# Altium schematic sheet FPGA.SchDoc
size B; SheetNumber: 2; SheetTotal: 5
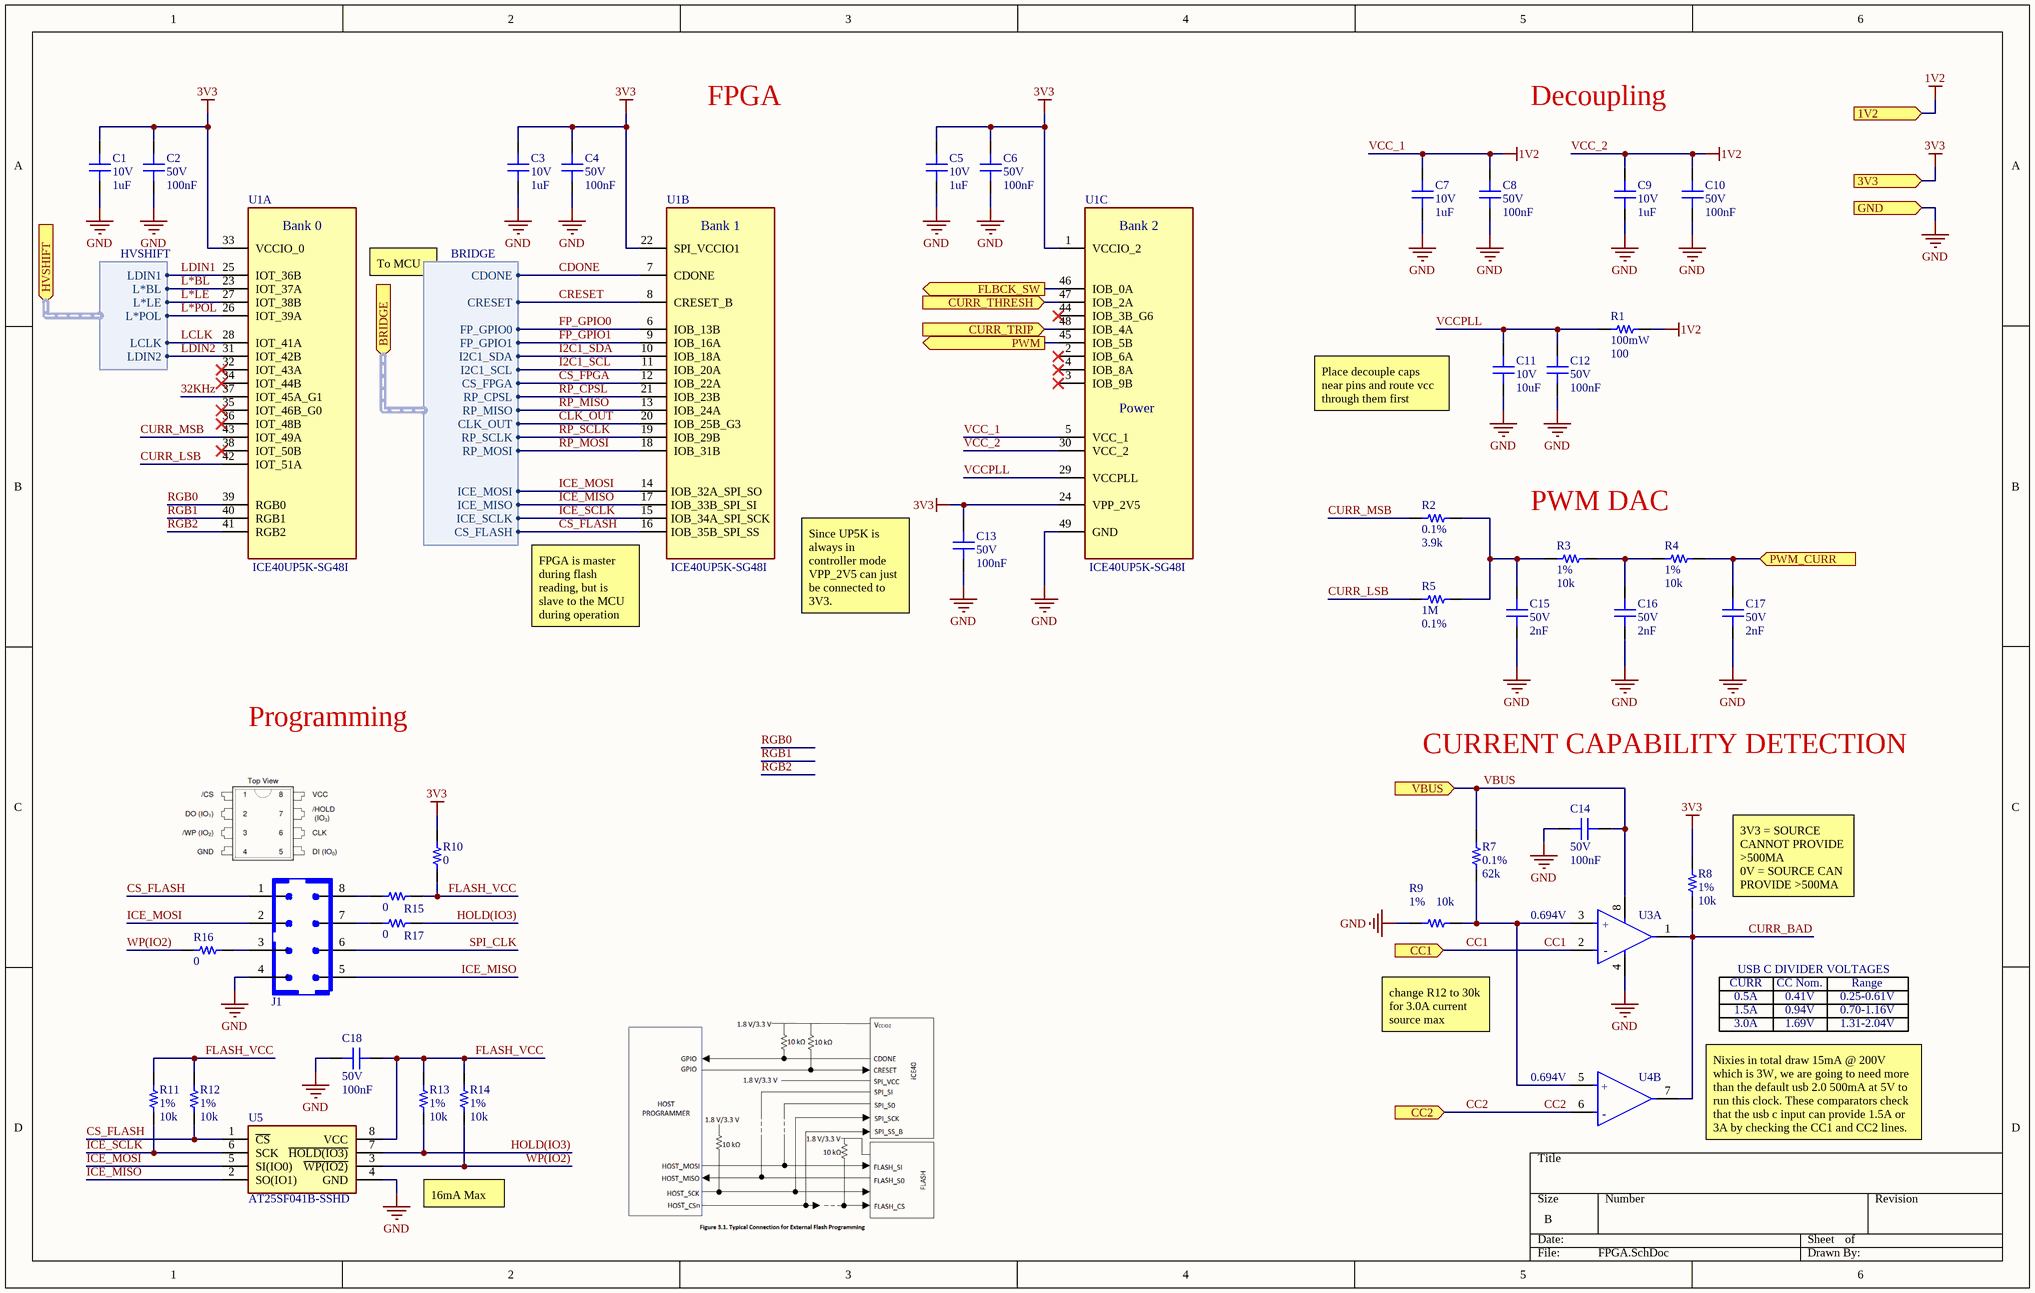
[diagram p0: FPGA.SchDoc]

## Parts
C1  Voltage Rating: 10V  Capacitance: 1uF  [0603]  (hidden comment: CL10B105KP8NFNC)
C2  Voltage Rating: 50V  Capacitance: 100nF  [0603]  (hidden comment: MT18B104K500CT)
C3  Voltage Rating: 10V  Capacitance: 1uF  [0603]  (hidden comment: CL10B105KP8NFNC)
C4  Voltage Rating: 50V  Capacitance: 100nF  [0603]  (hidden comment: MT18B104K500CT)
C5  Voltage Rating: 10V  Capacitance: 1uF  [0603]  (hidden comment: CL10B105KP8NFNC)
C6  Voltage Rating: 50V  Capacitance: 100nF  [0603]  (hidden comment: MT18B104K500CT)
C7  Voltage Rating: 10V  Capacitance: 1uF  [0603]  (hidden comment: CL10B105KP8NFNC)
C8  Voltage Rating: 50V  Capacitance: 100nF  [0603]  (hidden comment: MT18B104K500CT)
C9  Voltage Rating: 10V  Capacitance: 1uF  [0603]  (hidden comment: CL10B105KP8NFNC)
C10  Voltage Rating: 50V  Capacitance: 100nF  [0603]  (hidden comment: MT18B104K500CT)
C11  Voltage Rating: 10V  Capacitance: 10uF  [0603]  (hidden comment: 0603X106M100CT)
C12  Voltage Rating: 50V  Capacitance: 100nF  [0603]  (hidden comment: MT18B104K500CT)
C13  Voltage Rating: 50V  Capacitance: 100nF  [0603]  (hidden comment: MT18B104K500CT)
C14  Voltage Rating: 50V  Capacitance: 100nF  [0603]  (hidden comment: MT18B104K500CT)
C15  Voltage Rating: 50V  Capacitance: 2nF  [0603]  (hidden comment: GRM1885C1H202JA01D)
C16  Voltage Rating: 50V  Capacitance: 2nF  [0603]  (hidden comment: GRM1885C1H202JA01D)
C17  Voltage Rating: 50V  Capacitance: 2nF  [0603]  (hidden comment: GRM1885C1H202JA01D)
C18  Voltage Rating: 50V  Capacitance: 100nF  [0603]  (hidden comment: MT18B104K500CT)
J1  IDC 2x4 2.54mm DC3-8P  [2.54mm Pitch 1.1mm Drill 2x4P]  (value not drawn)
R1  Power Rating: 100mW  Resistance: 100  [0603]  (hidden comment: CRG0603F100R)
R2  Tolerance: 0.1%  Resistance: 3.9k  [0603]  (hidden comment: CPF0603B3K9E1)
R3  Tolerance: 1%  Resistance: 10k  [0603]  (hidden comment: CRG0603F10K)
R4  Tolerance: 1%  Resistance: 10k  [0603]  (hidden comment: CRG0603F10K)
R5  Resistance: 1M  Tolerance: 0.1%  [0603]  (hidden comment: CPF0603B1M0E)
R7  Tolerance: 0.1%  Resistance: 62k  [0603]  (hidden comment: CPF0603B62KE1)
R8  Tolerance: 1%  Resistance: 10k  [0603]  (hidden comment: CRG0603F10K)
R9  Tolerance: 1%  Resistance: 10k  [0603]  (hidden comment: CRG0603F10K)
R10  Resistance: 0  [0603]  (hidden comment: RC0603JR-070RL)
R11  Tolerance: 1%  Resistance: 10k  [0603]  (hidden comment: CRG0603F10K)
R12  Tolerance: 1%  Resistance: 10k  [0603]  (hidden comment: CRG0603F10K)
R13  Tolerance: 1%  Resistance: 10k  [0603]  (hidden comment: CRG0603F10K)
R14  Tolerance: 1%  Resistance: 10k  [0603]  (hidden comment: CRG0603F10K)
R15  Resistance: 0  [0603]  (hidden comment: RC0603JR-070RL)
R16  Resistance: 0  [0603]  (hidden comment: RC0603JR-070RL)
R17  Resistance: 0  [0603]  (hidden comment: RC0603JR-070RL)
U1  ICE40UP5K-SG48I  [QFN-48]  (parts A,B,C of 3)
U3  LM393DR2G  [SOIC-8]  (value not drawn)  (part A of 2)
U4  LM393DR2G  [SOIC-8]  (value not drawn)  (part B of 2)
U5  AT25SF041B-SSHD  [SOIC-8]

## Ports
1V2 (in, see Top Sheet[1C], Power[6B]), 3V3 (in, see Top Sheet[1C], Nixie[1A], Power[6A]), BRIDGE (in, harness BRIDGE, see Top Sheet[1C], MCU[3B]), CC1 (in, see Top Sheet[2A], Power[2A]), CC2 (in, see Top Sheet[2B], Power[2B]), CURR_THRESH (in, see Top Sheet[2B], Power[4D]), CURR_TRIP (in, see Top Sheet[2B], Power[5D]), FLBCK_SW (out, see Top Sheet[2B], Power[1C]), GND (in, see Top Sheet[1C], Nixie[1A], Power[1D]), HVSHIFT (in, harness HVSHIFT, see Top Sheet[2A], Nixie[1C]), PWM (out, see Top Sheet[2B], Power[2D]), PWM_CURR (in), VBUS (in, see Top Sheet[2B], Power[4A])

## Harnesses
BRIDGE: CS_FLASH, ICE_SCLK, ICE_MOSI, ICE_MISO, CDONE, CRESET, CS_FPGA, RP_SCLK, RP_MOSI, RP_MISO, RP_CPSL, CLK_OUT, FP_GPIO1, FP_GPIO0, I2C1_SCL, I2C1_SDA
HVSHIFT: LDIN1, L*BL, L*LE, L*POL, LCLK, LDIN2

## Nets
3V3: C1.2 C2.2 C3.2 C4.2 C5.2 C6.2 C13.2 R8.2 R10.2 U1.1(VCCIO_2) U1.22(SPI_VCCIO1) U1.24(VPP_2V5) U1.33(VCCIO_0) ; port 3V3
GND: C1.1 C2.1 C3.1 C4.1 C5.1 C6.1 C7.1 C8.1 C9.1 C10.1 C11.1 C12.1 C13.1 C14.2 C15.1 C16.1 C17.1 C18.2 J1.4 R9.1 U1.49(GND) U3.4(GND) U5.4(GND) ; port GND
VCC_1: C7.2 C8.2 C9.2 C10.2 R1.2 U1.5(VCC_1) U1.30(VCC_2) ; port 1V2  [also labelled 1V2, VCC_2]
32KHz: U1.37(IOT_45A_G1)
CC1: U3.2(IN1-) ; port CC1
CC2: U4.6(IN2-) ; port CC2
CDONE: U1.7(CDONE) ; port BRIDGE.CDONE
CLK_OUT: U1.20(IOB_25B_G3) ; port BRIDGE.CLK_OUT
CRESET: U1.8(CRESET_B) ; port BRIDGE.CRESET
CS_FLASH: J1.1 R12.1 U1.16(IOB_35B_SPI_SS) U5.1(~{CS}) ; port BRIDGE.CS_FLASH
CS_FPGA: U1.12(IOB_22A) ; port BRIDGE.CS_FPGA
CURR_BAD: R8.1 U3.1(OUT1) U4.7(OUT2)
CURR_LSB: R5.1 U1.42(IOT_51A)
CURR_MSB: R2.1 U1.43(IOT_49A)
CURR_THRESH: U1.47(IOB_2A) ; port CURR_THRESH
CURR_TRIP: U1.48(IOB_4A) ; port CURR_TRIP
FLASH_VCC: C18.1 R10.1 R11.2 R12.2 R13.2 R14.2 R15.2 U5.8(VCC)
FLBCK_SW: U1.46(IOB_0A) ; port FLBCK_SW
FP_GPIO0: U1.6(IOB_13B) ; port BRIDGE.FP_GPIO0
FP_GPIO1: U1.9(IOB_16A) ; port BRIDGE.FP_GPIO1
HOLD(IO3): R13.1 R17.2 U5.7(~{HOLD(IO3)})
I2C1_SCL: U1.11(IOB_20A) ; port BRIDGE.I2C1_SCL
I2C1_SDA: U1.10(IOB_18A) ; port BRIDGE.I2C1_SDA
ICE_MISO: J1.5 U1.17(IOB_33B_SPI_SI) U5.2(SO(IO1)) ; port BRIDGE.ICE_MISO
ICE_MOSI: J1.2 U1.14(IOB_32A_SPI_SO) U5.5(SI(IO0)) ; port BRIDGE.ICE_MOSI
ICE_SCLK: R11.1 U1.15(IOB_34A_SPI_SCK) U5.6(SCK) ; port BRIDGE.ICE_SCLK
L*BL: U1.23(IOT_37A) ; port HVSHIFT.L*BL
L*LE: U1.27(IOT_38B) ; port HVSHIFT.L*LE
L*POL: U1.26(IOT_39A) ; port HVSHIFT.L*POL
LCLK: U1.28(IOT_41A) ; port HVSHIFT.LCLK
LDIN1: U1.25(IOT_36B) ; port HVSHIFT.LDIN1
LDIN2: U1.31(IOT_42B) ; port HVSHIFT.LDIN2
PWM: U1.45(IOB_5B) ; port PWM
PWM_CURR: C17.2 R4.1 ; port PWM_CURR
RGB0: U1.39(RGB0)
RGB1: U1.40(RGB1)
RGB2: U1.41(RGB2)
RP_CPSL: U1.21(IOB_23B) ; port BRIDGE.RP_CPSL
RP_MISO: U1.13(IOB_24A) ; port BRIDGE.RP_MISO
RP_MOSI: U1.18(IOB_31B) ; port BRIDGE.RP_MOSI
RP_SCLK: U1.19(IOB_29B) ; port BRIDGE.RP_SCLK
SPI_CLK: J1.6
VBUS: C14.1 R7.2 U3.8(V+) ; port VBUS
VCCPLL: C11.2 C12.2 R1.1 U1.29(VCCPLL)
WP(IO2): R14.1 R16.1 U5.3(~{WP(IO2)})
NetC15_2: C15.2 R2.2 R3.2 R5.2
NetC16_2: C16.2 R3.1 R4.2
NetJ1_3: J1.3 R16.2
NetJ1_7: J1.7 R17.1
NetJ1_8: J1.8 R15.1
NetR7_1: R7.1 R9.2 U3.3(IN1+) U4.5(IN2+)

Not connected (* = marked no-connect by the designer): U1 2(IOB_6A)* 3(IOB_9B)* 4(IOB_8A)* 32(IOT_43A)* 34(IOT_44B)* 35(IOT_46B_G0)* 36(IOT_48B)* 38(IOT_50B)* 44(IOB_3B_G6)*

## Notes on the sheet
- FPGA
- Decoupling
- To MCU
- Place decouple caps near pins and route vcc through them first
- PWM DAC
- (near U1) FPGA is master during flash reading, but is slave to the MCU during operation
- Since UP5K is always in controller mode VPP_2V5 can just be connected to 3V3.
- Programming
- CURRENT CAPABILITY DETECTION
- (near R8) 3V3 = SOURCE CANNOT PROVIDE >500MA
  0V = SOURCE CAN PROVIDE >500MA
- (near U3) 0.694V
- USB C DIVIDER VOLTAGES
- change R12 to 30k for 3.0A current source max
- CURR
- 0.5A
- 1.5A
- 3.0A
- CC Nom.
- 0.41V
- 0.94V
- 1.69V
- Range
- 0.25-0.61V
- 0.70-1.16V
- 1.31-2.04V
- (near U4) 0.694V
- Nixies in total draw 15mA @ 200V which is 3W, we are going to need more than the default usb 2.0 500mA at 5V to run this clock. These comparators check that the usb c input can provide 1.5A or 3A by checking the CC1 and CC2 lines.
- 16mA Max
- (in symbol ICE40UP5K-SG48I, part A) Bank 0
- (in symbol ICE40UP5K-SG48I, part B) Bank 1
- (in symbol ICE40UP5K-SG48I, part C) Bank 2; Power
- (in symbol LM393DR2G, part A) +; -
- (in symbol LM393DR2G, part B) +; -

## Library data of the parts
C1 C3 C5 C7 C9 = CL10B105KP8NFNC: 1 µF ±10% 10V Ceramic Capacitor X7R 0603 (1608 Metric); Dielectric: X7R; Tolerance: 10%
C2 C4 C6 C8 C10 C12-C14 C18 = MT18B104K500CT: 0.1 µF ±10% 50V Ceramic Capacitor X7R 0603 (1608 Metric); Dielectric: X7R; Tolerance: 10%
C11 = 0603X106M100CT: 10 µF ±20% 10V Ceramic Capacitor X5R 0603 (1608 Metric); Dielectric: X5R; Tolerance: 20%
C15-C17 = GRM1885C1H202JA01D: 2000 pF ±5% 50V Ceramic Capacitor C0G, NP0 0603 (1608 Metric); Dielectric: C0G (NP0); Tolerance: 5%
J1 = IDC 2x4 2.54mm DC3-8P: Straight idc box headers PCB CONNECTOR DOUBLE ROW DC3 HEADER; M/F: Male; Rows: 2; Pins: 8; Pitch: 2.54mm
R1 = CRG0603F100R: 100 Ohms ±1% 0.1W, 1/10W Chip Resistor 0603 (1608 Metric) Thick Film; Temperature Coefficient: 100ppm/c; Tolerance: 1%; Case Code: 0603
R2 = CPF0603B3K9E1: 3.9 kOhms ±0.1% 0.063W, 1/16W Chip Resistor 0603 (1608 Metric) Thin Film; Power Rating: 62.5mW; Temperature Coefficient: 25ppm/c; Case Code: 0603
R3 R4 R8 R9 R11-R14 = CRG0603F10K: 10 kOhms ±1% 0.1W, 1/10W Chip Resistor 0603 (1608 Metric) Thick Film; Power Rating: 100mW; Temperature Coefficient: 100ppm/c; Case Code: 0603
R5 = CPF0603B1M0E: 1 MOhms ±0.1% 0.063W, 1/16W Chip Resistor 0603 (1608 Metric) Thin Film; Power Rating: 62.5mW; Temperature Coefficient: 25ppm/c; Case Code: 0603
R7 = CPF0603B62KE1: 62 kOhms ±0.1% 0.063W, 1/16W Chip Resistor 0603 (1608 Metric) Thin Film; Power Rating: 62.5mW; Temperature Coefficient: 25ppm/c; Case Code: 0603
R10 R15-R17 = RC0603JR-070RL: 0 Ohms Jumper 0.1W, 1/10W Chip Resistor 0603 (1608 Metric) Moisture Resistant Thick Film; Temperature Coefficient: 0ppm/c; Tolerance: 0%; Power Rating: 100mW; Case Code: 0603
U1 = ICE40UP5K-SG48I: FPGA - Field Programmable Gate Array iCE40-UltraPlus, 5280 LUTs, 1.2V
U3 U4 = LM393DR2G: Comparator Standard (General Purpose) Open-Collector, Rail-to-Rail 8-SOIC
U5 = AT25SF041B-SSHD: FLASH - NOR Memory IC 4Mbit SPI - Quad I/O 108 MHz 8-SOIC